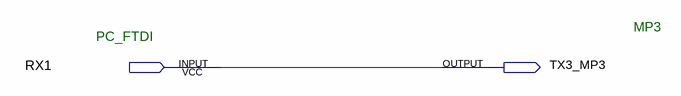
[diagram p0: schematic sheet]
// Quartus schematic test_MP3.bdf as structural Verilog: 0 symbols, 2 pins
module test_MP3 (
  input  RX1,
  output TX3_MP3
);


  assign TX3_MP3 = RX1;

  // Notes on the sheet:
  //   MP3
  //   PC_FTDI
endmodule
